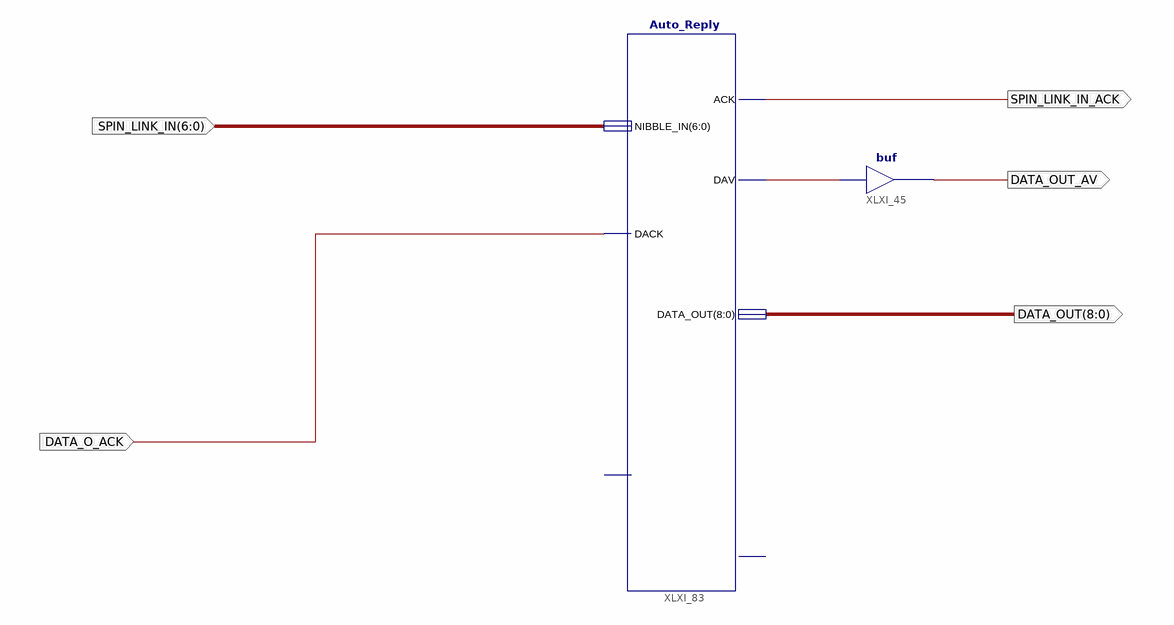
[diagram p0: schematic sheet 1]
// Xilinx ISE schematic Spin_link_input.sch (xbr) as structural Verilog: 2 symbols, 5 ports
module Spin_link_input (
  input  [6:0] SPIN_LINK_IN,
  input  DATA_O_ACK,
  output SPIN_LINK_IN_ACK,
  output DATA_OUT_AV,
  output [8:0] DATA_OUT
);

  wire XLXN_282;

  Auto_Reply XLXI_83 (
    .DACK(DATA_O_ACK), .NIBBLE_IN(SPIN_LINK_IN), .ACK(SPIN_LINK_IN_ACK), .DAV(XLXN_282), .DATA_OUT(DATA_OUT));  // open: NIBBLE_CLEAR, DACK_CLEAR
  buf XLXI_45 (DATA_OUT_AV, XLXN_282);
endmodule
